# Altium schematic sheet schematic.SchDoc
size A4; SheetNumber: 1; SheetTotal: 1
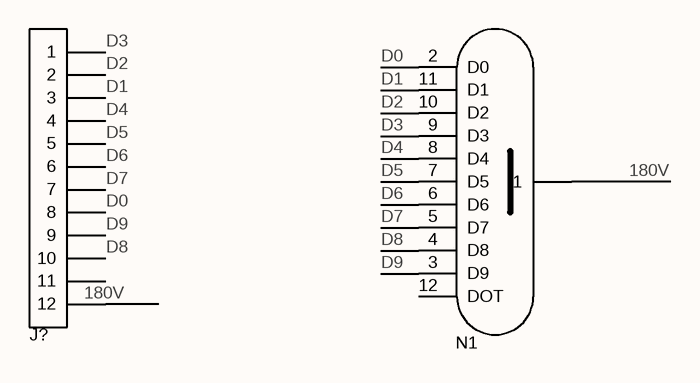
[diagram p0: schematic.SchDoc]

## Parts
J?  Header 2mm  [male edge connector]  (value not drawn)
N1  nixie_socket  [NIXIE SOCKET]  (value not drawn)

## Nets
180V: J?.12 N1.1
D0: J?.8 N1.2(D0)
D1: J?.3 N1.11(D1)
D2: J?.2 N1.10(D2)
D3: J?.1 N1.9(D3)
D4: J?.4 N1.8(D4)
D5: J?.5 N1.7(D5)
D6: J?.6 N1.6(D6)
D7: J?.7 N1.5(D7)
D8: J?.10 N1.4(D8)
D9: J?.9 N1.3(D9)

Not connected (* = marked no-connect by the designer): J? 11; N1 12(DOT)

## Library data of the parts
J? = edge connector_male: Header male 1x6, pitch 2mm; ComponentLink1Description: link